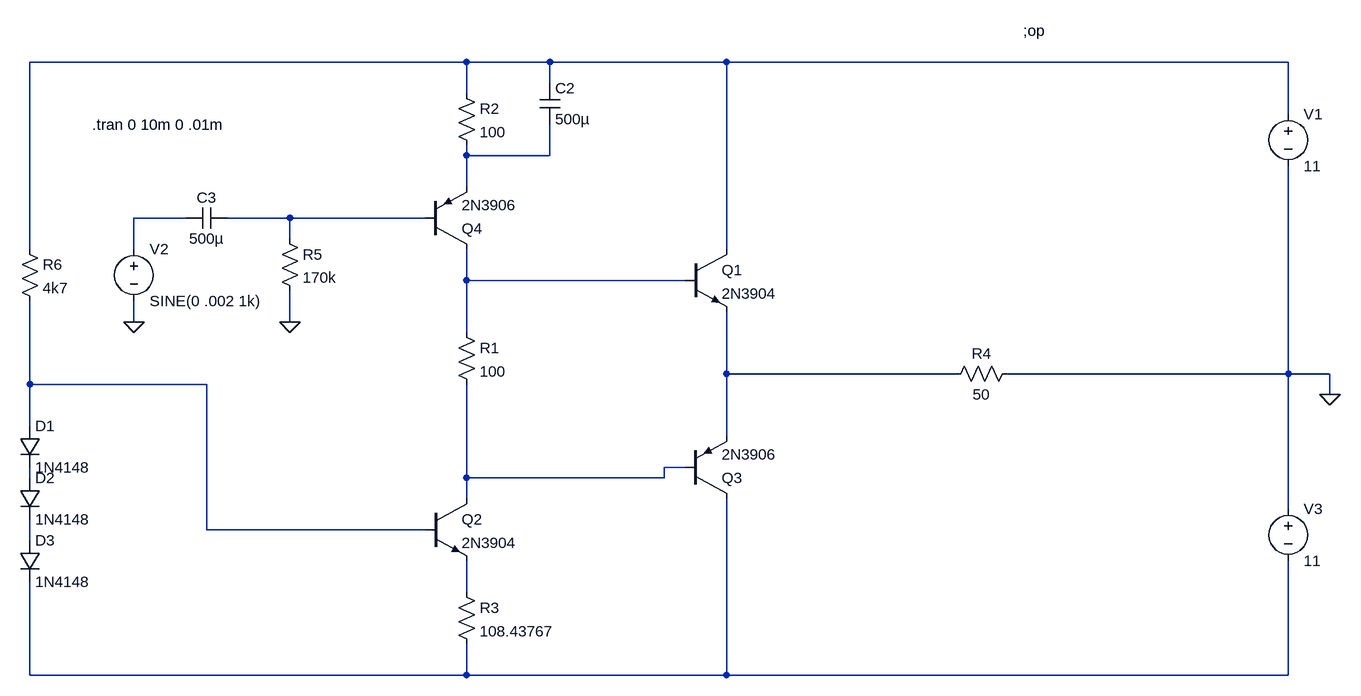
[diagram p0: schematic claseb2017.asc]
claseb2017.asc, the LTspice schematic file:
Version 4
SHEET 1 1748 680
WIRE 144 -640 -528 -640
WIRE 272 -640 144 -640
WIRE 544 -640 272 -640
WIRE 1408 -640 544 -640
WIRE 272 -608 272 -640
WIRE 144 -592 144 -640
WIRE 1408 -560 1408 -640
WIRE 144 -496 144 -512
WIRE 272 -496 272 -544
WIRE 272 -496 144 -496
WIRE 144 -448 144 -496
WIRE -288 -400 -368 -400
WIRE -128 -400 -224 -400
WIRE -32 -400 -128 -400
WIRE 80 -400 -32 -400
WIRE -128 -368 -128 -400
WIRE -528 -352 -528 -640
WIRE -368 -352 -368 -400
WIRE 544 -352 544 -640
WIRE 144 -304 144 -352
WIRE 224 -304 144 -304
WIRE 480 -304 224 -304
WIRE -368 -240 -368 -272
WIRE -128 -240 -128 -288
WIRE 144 -224 144 -304
WIRE 544 -160 544 -256
WIRE 592 -160 544 -160
WIRE 896 -160 592 -160
WIRE 1408 -160 1408 -480
WIRE 1408 -160 976 -160
WIRE 1472 -160 1408 -160
WIRE -528 -144 -528 -272
WIRE -256 -144 -528 -144
WIRE 1472 -128 1472 -160
WIRE -528 -80 -528 -144
WIRE 544 -64 544 -160
WIRE 480 -16 448 -16
WIRE -528 0 -528 -16
WIRE 144 0 144 -144
WIRE 352 0 144 0
WIRE 448 0 448 -16
WIRE 448 0 352 0
WIRE 144 32 144 0
WIRE 1408 48 1408 -160
WIRE -256 80 -256 -144
WIRE 80 80 -256 80
WIRE -528 96 -528 64
WIRE 144 160 144 128
WIRE 144 176 144 160
WIRE -528 304 -528 160
WIRE 144 304 144 256
WIRE 144 304 -528 304
WIRE 544 304 544 32
WIRE 544 304 144 304
WIRE 1408 304 1408 128
WIRE 1408 304 544 304
FLAG 1472 -128 0
FLAG -368 -240 0
FLAG -128 -240 0
DATAFLAG 592 -160 ""
DATAFLAG 144 -496 ""
DATAFLAG 144 160 ""
DATAFLAG 224 -304 ""
DATAFLAG 352 0 ""
DATAFLAG -32 -400 ""
SYMBOL res 128 -608 R0
SYMATTR InstName R2
SYMATTR Value 100
SYMBOL res 128 160 R0
SYMATTR InstName R3
SYMATTR Value 108.43767
SYMBOL voltage 1408 -576 R0
WINDOW 123 0 0 Left 2
WINDOW 39 0 0 Left 2
SYMATTR InstName V1
SYMATTR Value 11
SYMBOL res -144 -384 R0
SYMATTR InstName R5
SYMATTR Value 170k
SYMBOL res -544 -368 R0
SYMATTR InstName R6
SYMATTR Value 4k7
SYMBOL diode -544 -80 R0
SYMATTR InstName D1
SYMATTR Value 1N4148
SYMBOL diode -544 0 R0
SYMATTR InstName D2
SYMATTR Value 1N4148
SYMBOL diode -544 96 R0
SYMATTR InstName D3
SYMATTR Value 1N4148
SYMBOL cap 256 -608 R0
SYMATTR InstName C2
SYMATTR Value 500µ
SYMBOL cap -224 -416 R90
WINDOW 0 0 32 VBottom 2
WINDOW 3 32 32 VTop 2
SYMATTR InstName C3
SYMATTR Value 500µ
SYMBOL voltage -368 -368 R0
WINDOW 123 0 0 Left 2
WINDOW 39 0 0 Left 2
SYMATTR InstName V2
SYMATTR Value SINE(0 .002 1k)
SYMBOL npn 480 -352 R0
SYMATTR InstName Q1
SYMATTR Value 2N3904
SYMBOL npn 80 32 R0
SYMATTR InstName Q2
SYMATTR Value 2N3904
SYMBOL pnp 480 32 M180
SYMATTR InstName Q3
SYMATTR Value 2N3906
SYMBOL pnp 80 -352 M180
SYMATTR InstName Q4
SYMATTR Value 2N3906
SYMBOL voltage 1408 32 R0
WINDOW 123 0 0 Left 2
WINDOW 39 0 0 Left 2
SYMATTR InstName V3
SYMATTR Value 11
SYMBOL res 128 -240 R0
SYMATTR InstName R1
SYMATTR Value 100
SYMBOL res 992 -176 R90
WINDOW 0 0 56 VBottom 2
WINDOW 3 32 56 VTop 2
SYMATTR InstName R4
SYMATTR Value 50
TEXT 1000 -688 Left 2 !;op
TEXT -432 -544 Left 2 !.tran 0 10m 0 .01m

The netlist it stands for:
* claseb2017.asc
R2 N001 N002 100
R3 N011 N012 108.43767
V1 N001 0 11
R5 N004 0 170k
R6 N001 N007 4k7
D1 N007 N009 1N4148
D2 N009 N010 1N4148
D3 N010 N012 1N4148
C2 N001 N002 500µ
C3 N004 N003 500µ
V2 N003 0 SINE(0 .002 1k)
Q1 N001 N005 N006 0 2N3904
Q2 N008 N007 N011 0 2N3904
Q3 N012 N008 N006 0 2N3906
Q4 N005 N004 N002 0 2N3906
V3 0 N012 11
R1 N005 N008 100
R4 0 N006 50
.model D D
.lib standard.dio
.model NPN NPN
.model PNP PNP
.lib standard.bjt
;op
.tran 0 10m 0 .01m
.backanno
.end